# Altium schematic sheet Communication.SchDoc: BluetoothGateway
size A; DrawnBy: Q.Thang & T.Khoa; Revision: V1.0.0; SheetNumber: 8; SheetTotal: 17
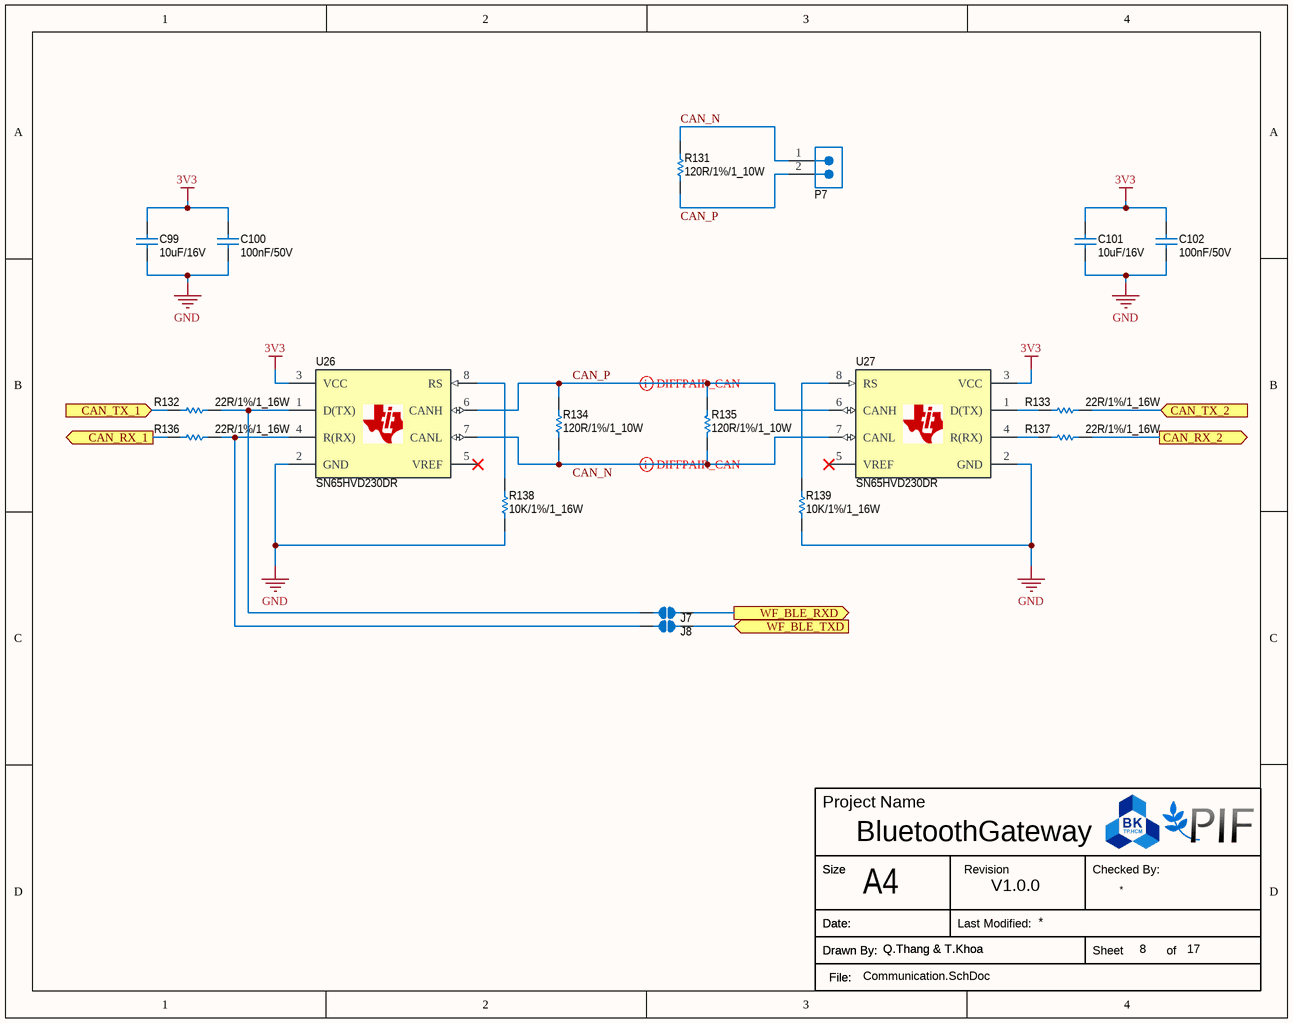
[diagram p0: Communication.SchDoc]

## Parts
C99  10uF/16V  [CAP_0603]
C100  100nF/50V  [CAP_0603]
C101  10uF/16V  [CAP_0603]
C102  100nF/50V  [CAP_0603]
J7  Jumper_Open  [SolderBridgeOpen]  (value not drawn)
J8  Jumper_Open  [SolderBridgeOpen]  (value not drawn)
P7  3.81mm_2P  [Terminal_Block_3.81mm_2P]  (value not drawn)
R131  120R/1%/1_10W  [Resistor_0603]
R132  22R/1%/1_16W  [RESISTOR_0402]
R133  22R/1%/1_16W  [RESISTOR_0402]
R134  120R/1%/1_10W  [Resistor_0603]
R135  120R/1%/1_10W  [Resistor_0603]
R136  22R/1%/1_16W  [RESISTOR_0402]
R137  22R/1%/1_16W  [RESISTOR_0402]
R138  10K/1%/1_16W  [RESISTOR_0402]
R139  10K/1%/1_16W  [RESISTOR_0402]
U26  SN65HVD230DR  [SOIC-8]
U27  SN65HVD230DR  [SOIC-8]

## Ports
CAN_RX_1 (out, see Overview_Schematic[4B]), CAN_RX_2 (out, see Overview_Schematic[5B]), CAN_TX_1 (in, see Overview_Schematic[4B]), CAN_TX_2 (in, see Overview_Schematic[5B]), WF_BLE_RXD (out, see Overview_Schematic[5B], ESP32_WiFi[4B]), WF_BLE_TXD (in, see Overview_Schematic[5B], ESP32_WiFi[4B])

## Nets
3V3: C99.2 C100.2 C101.2 C102.2 U26.3(VCC) U27.3(VCC)
GND: C99.1 C100.1 C101.1 C102.1 R138.2 R139.2 U26.2(GND) U27.2(GND)
CAN_N: P7.1 R131.2 R134.1 R135.2 U26.7(CANL) U27.7(CANL)
CAN_P: P7.2 R131.1 R134.2 R135.1 U26.6(CANH) U27.6(CANH)
CAN_RX_1: R136.1 ; port CAN_RX_1
CAN_RX_2: R137.2 ; port CAN_RX_2
CAN_TX_1: R132.1 ; port CAN_TX_1
CAN_TX_2: R133.2 ; port CAN_TX_2
WF_BLE_RXD: J7.2 ; port WF_BLE_RXD
WF_BLE_TXD: J8.2 ; port WF_BLE_TXD
NetJ7_1: J7.1 R132.2 U26.1(D(TX))
NetJ8_1: J8.1 R136.2 U26.4(R(RX))
NetR133_1: R133.1 U27.1(D(TX))
NetR137_1: R137.1 U27.4(R(RX))
NetR138_1: R138.1 U26.8(RS)
NetR139_1: R139.1 U27.8(RS)

Not connected (* = marked no-connect by the designer): U26 5(VREF)*; U27 5(VREF)*

## Layout directives
differential pair: CAN_N, CAN_P

## Notes on the sheet
- Project Name
- Size
- A4
- Revision
- Checked By:
- Drawn By:
- Date:
- File:
- Last Modified:
- Sheet
- of

## Library data of the parts
C99 C101 = Ceramic_Cap_10uF_16V_0603: CAP, size 0603, 10uF, 16V; Supply Part Number: Tụ Gốm 0603 10uF 16V; Supply Name: Thegioiic; Datasheet: *; Supply URL: https://www.thegioiic.com/tu-gom-0603-10uf-16v
C100 C102 = Ceramic_Cap_100nF_50V_0603: CAP, size 0603, 100nF, 50V; Supply Part Number: Tụ Gốm 0603 100nF (0.1uF) 50V; Supply Name: Thegioiic; Datasheet: *; Supply URL: https://www.thegioiic.com/tu-gom-0603-100nf-0-1uf-50v
P7 = Terminal_Block_3.81mm_2P: Terminal Block THT, pitch 3.81mm, 2p, 300V, 10A; Supply Part Number: UL-3.81-2-R Terminal Block Plug-in Hàn PCB 2 Chân Cong 3.81mm 300V 10A ULO; Supply Name: Thegioiic; Supply URL: https://www.thegioiic.com/ul-3-81-2-r-terminal-block-plug-in-han-pcb-2-chan-cong-3-81mm-300v-10a-ulo
R131 R134 R135 = Res_120R_0603_1%: Resistor 0603 120 Ohm 1% 1_10W; Supply Part Number: Điện Trở 120 Ohm 0603 1%; Supply Name: Thegioiic; Supply URL: https://www.thegioiic.com/dien-tro-120-ohm-0603-1-
R132 R133 R136 R137 = Res_22R_0402_1%: Resistor 0402 22 Ohm 1% 1_16W; Supply Name: *; Supply Part Number: *; Supply URL: *
R138 R139 = Res_10K_0402_1%: Resistor 0402 10KOhm 1% 1_16W; Supply Part Number: Điện Trở 10 KOhm 0402 1%; Supply Name: Thegioiic; Supply URL: https://www.thegioiic.com/dien-tro-10-kohm-0402-1-
U26 U27 = SN65HVD230DR: 1/1 Transceiver Half CANbus; Supply Part Number: SN65HVD230DR CAN Transceiver 8-SOIC; Supply Name: Thegioiic; Datasheet: https://www.ti.com/lit/ds/symlink/sn65hvd230.pdf; Supply URL: https://www.thegioiic.com/sn65hvd230dr-can-transceiver-8-soic
J7 J8 = Jumper_Open: Datasheet: *; Supply Name: *; Supply Part Number: *; Supply URL: *